# EAGLE schematic battery-source-resistance-outline (EAGLE 9.6.2)
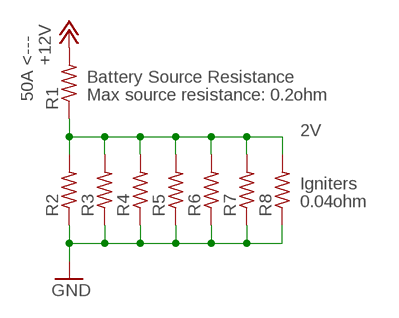
[diagram p0: schematic, sheet 1]

## Parts
R1  R-US_0617/5V  [0617V]
R2  R-US_0617/5V  [0617V]
R3  R-US_0617/5V  [0617V]
R4  R-US_0617/5V  [0617V]
R5  R-US_0617/5V  [0617V]
R6  R-US_0617/5V  [0617V]
R7  R-US_0617/5V  [0617V]
R8  R-US_0617/5V  [0617V]

## Nets
+12V: R1.2
GND: R2.1 R3.1 R4.1 R5.1 R6.1 R7.1 R8.1
N$1: R1.1 R2.2 R3.2 R4.2 R5.2 R6.2 R7.2 R8.2

## Notes on the sheet
- Battery Source Resistance
- 50A <--- | Max source resistance: 0.2ohm
- 2V
- Igniters
- 0.04ohm

## Library data of the parts
R1-R8 = rcl:R-US_: RESISTOR, American symbol; SPICEPREFIX: R